# EAGLE design MSP-EXP432P401R_rigid (EAGLE 7.7.0)
AUTHOR: Mike Stein; REV: 2.0
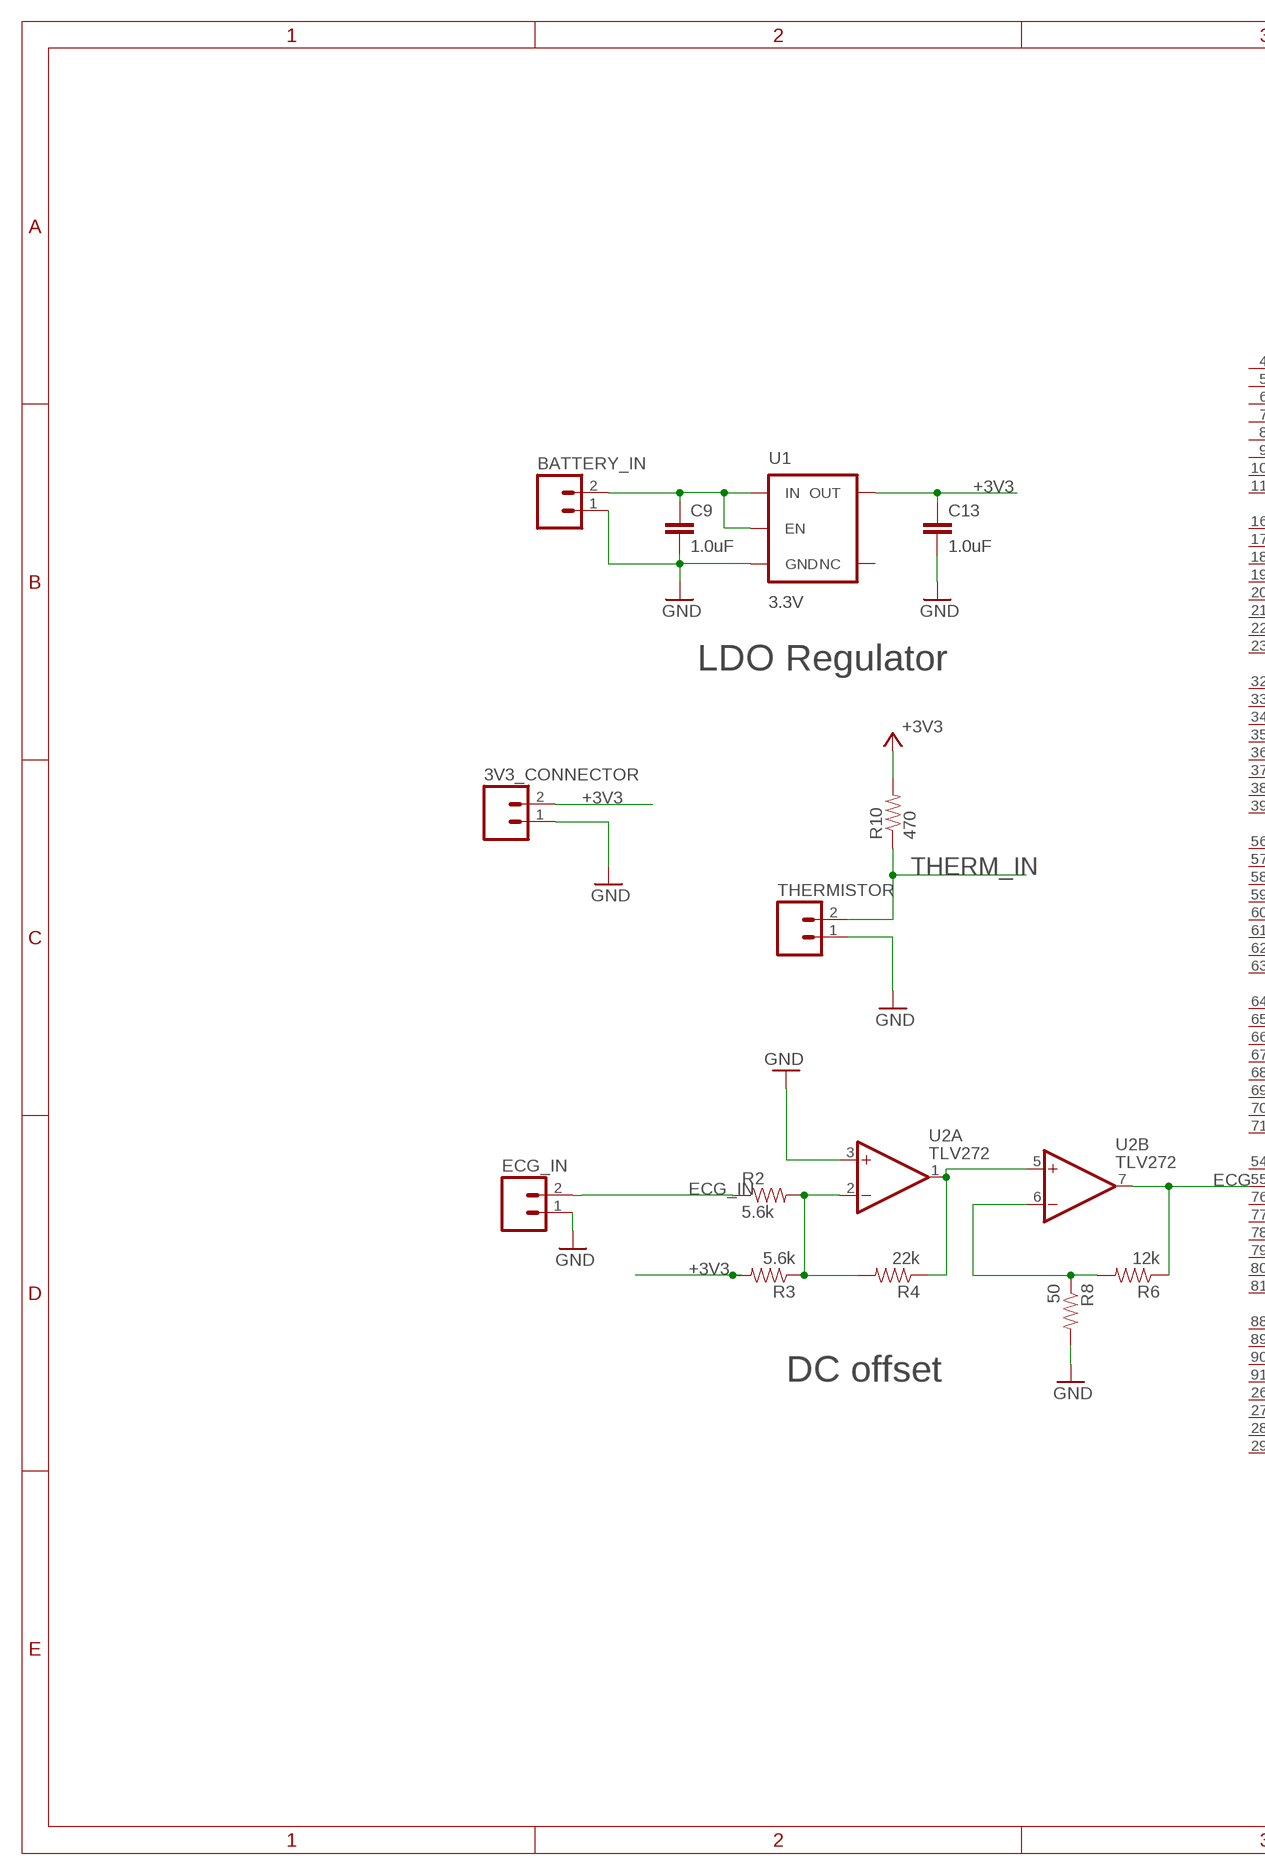
[diagram p0: schematic, sheet 1, part 1 of 2]
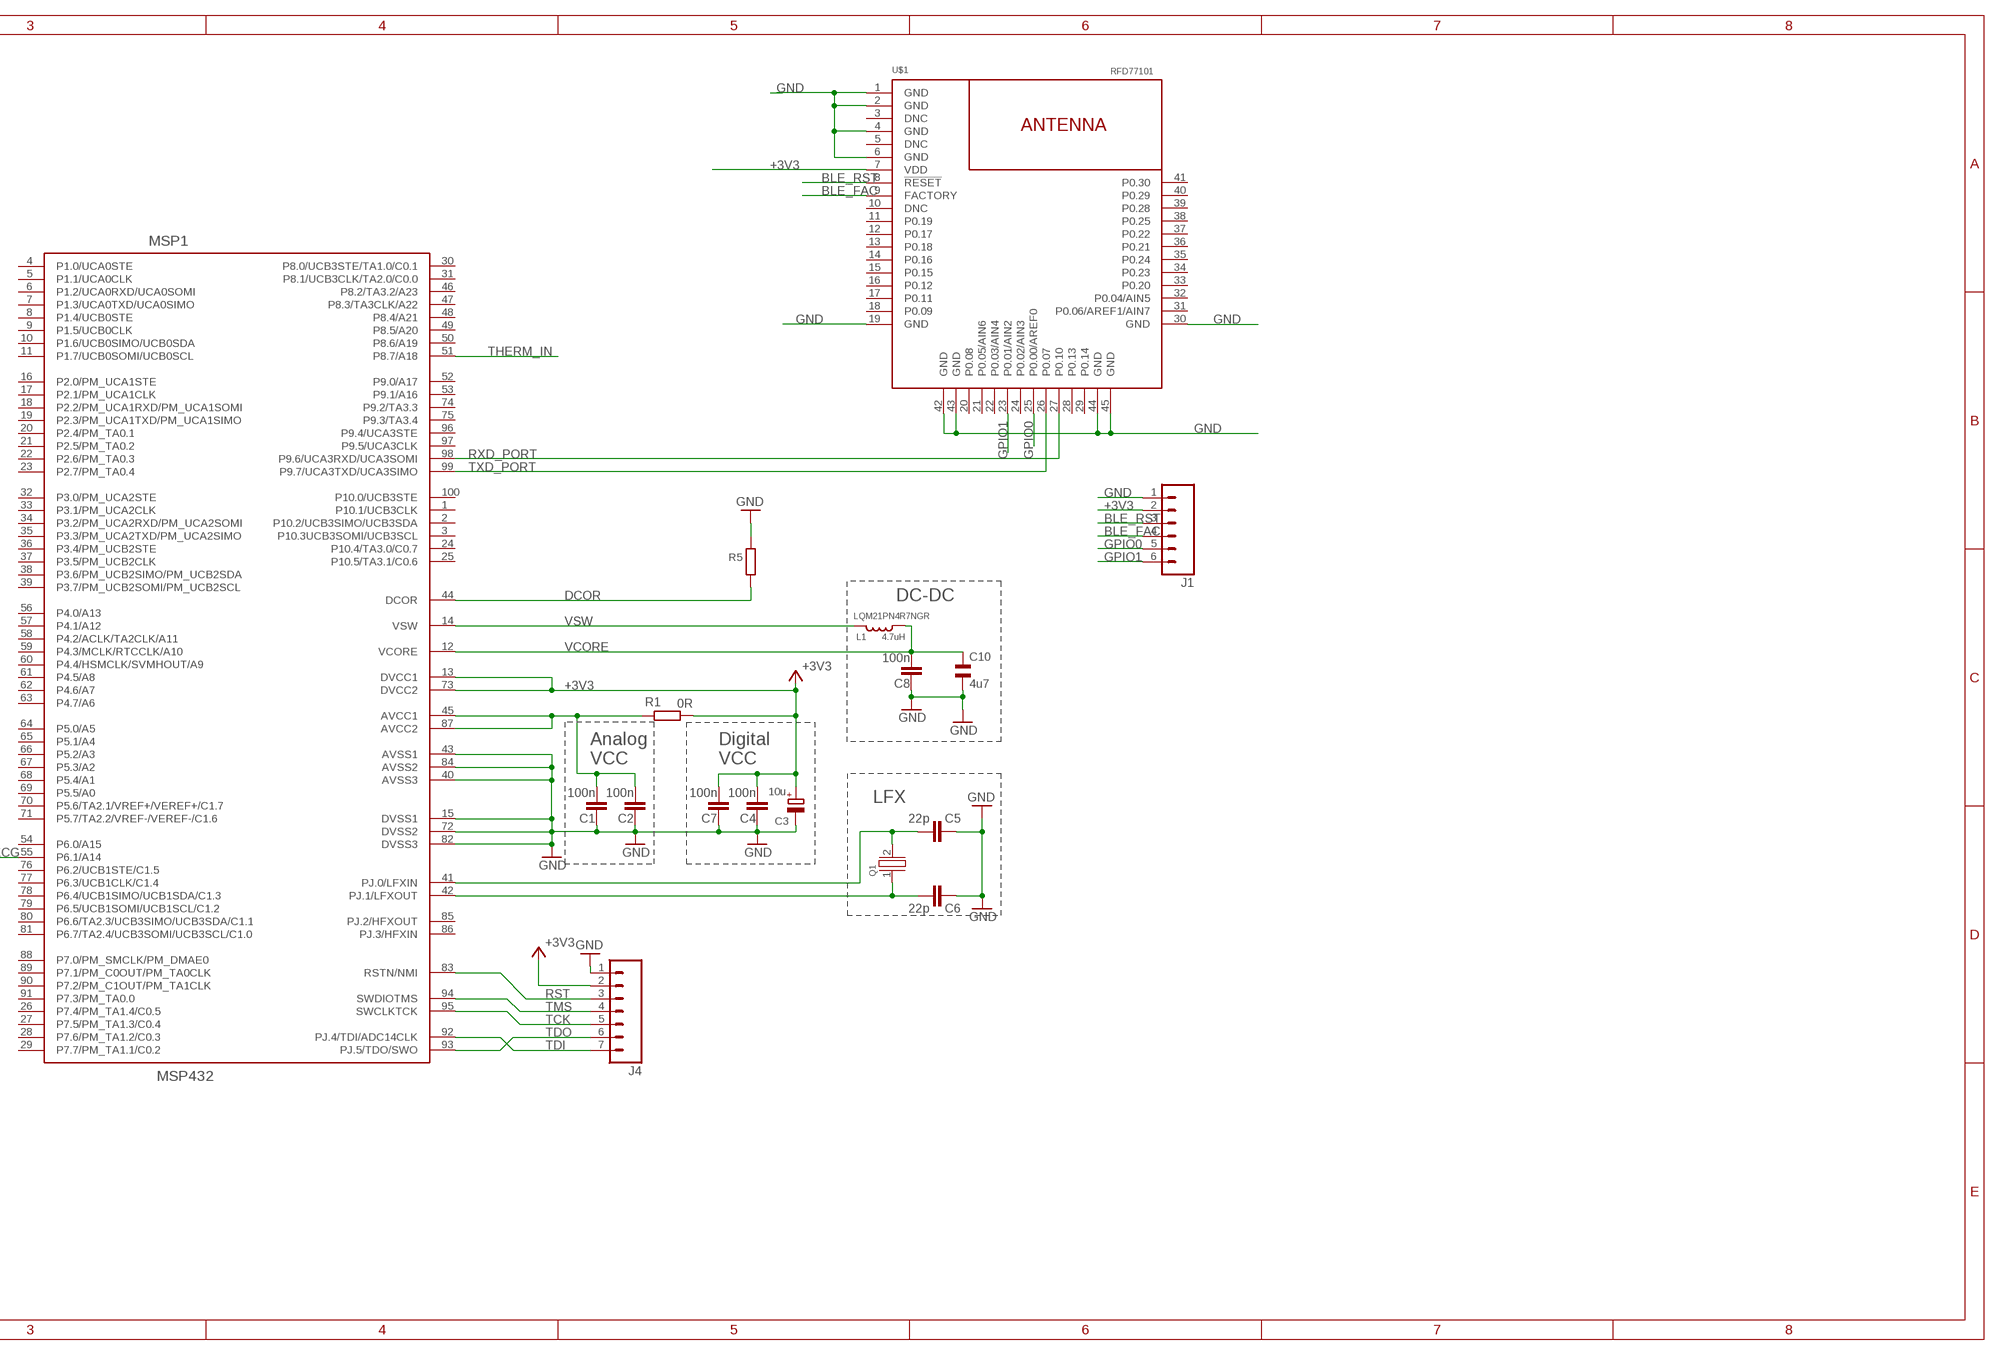
[diagram p1: schematic, sheet 1, part 2 of 2]

## Parts
3V3_CONNECTOR  M02PTH  [1X02]
BATTERY_IN  M02PTH  [1X02]
C1  100n  C-EUCM0402  [0402]
C2  100n  C-EUCM0402  [0402]
C3  10u  CPOL-EUA/3216-18R  [A/3216-18R]
C4  100n  C-EUCM0402  [0402]
C5  22p  C-EUCM0402  [0402]
C6  22p  C-EUCM0402  [0402]
C7  100n  C-EUCM0402  [0402]
C8  100n  C-EUCM0402  [0402]
C9  1.0uF  1.0UF-25V-+80/-20(0805)"  [0805-CAP]
C10  4u7  CSMD0805  [CSMD0805]
C13  1.0uF  1.0UF-25V-+80/-20(0805)"  [0805-CAP]
ECG_IN  M02PTH  [1X02]
J1  M06SILK_FEMALE_PTH  [1X06]
J4  M07  [1X07]
L1  4.7uH  LQM2MP_G0  [0806]
MSP1  MSP432  [PZ100]
Q1  CRYSTALLF_GENERAL  [LF_XTAL]
R1  0R  R-EU_RM0402  [0402]
R2  5.6k  RESISTOR0402-RES  [0402-RES]
R3  5.6k  RESISTOR0402-RES  [0402-RES]
R4  22k  RESISTOR0402-RES  [0402-RES]
R5  R_0805  [0805]
R6  12k  RESISTOR0402-RES  [0402-RES]
R8  50  RESISTOR0402-RES  [0402-RES]
R10  470  RESISTOR0402-RES  [0402-RES]
THERMISTOR  M02PTH  [1X02]
U1  3.3V  V_REG_AP2112K-3.3V  [SOT23-5]
U2  TLV272  TL082D  [SO08]
U$1  RFD77101  [RFD77101]

## Nets
+3V3: 3V3_CONNECTOR.2 C3.+ C4.1 C7.1 C13.1 J1.2 J4.2 MSP1.13(DVCC1) MSP1.73(DVCC2) R1.1 R3.2 R10.2 U1.5(OUT) U$1.7(VDD)
BLE_FAC: J1.4 U$1.9(FACTORY)
BLE_RST: J1.3 U$1.8(!RESET!)
DCOR: MSP1.44(DCOR) R5.1
ECG: MSP1.55(P6.1/A14) R6.1 U2.7(B:OUT)
ECG_IN: ECG_IN.2 R2.1
GND: 3V3_CONNECTOR.1 BATTERY_IN.1 C1.2 C2.2 C3.- C4.2 C5.2 C6.2 C7.2 C8.2 C9.2 C10.2 C13.2 ECG_IN.1 J1.1 J4.1 MSP1.15(DVSS1) MSP1.40(AVSS3) MSP1.43(AVSS1) MSP1.72(DVSS2) MSP1.82(DVSS3) MSP1.84(AVSS2) R5.2 R8.2 THERMISTOR.1 U1.2(GND) U2.3(A:+IN) U$1.1(GND) U$1.2(GND) U$1.4(GND) U$1.6(GND) U$1.19(GND) U$1.30(GND) U$1.42(GND) U$1.43(GND) U$1.44(GND) U$1.45(GND)
GPIO0: J1.5 U$1.25(P0.00/AREF0)
GPIO1: J1.6 U$1.23(P0.01/AIN2)
N$1: BATTERY_IN.2 C9.1 U1.1(IN) U1.3(EN)
N$5: R2.2 R3.1 R4.2 U2.2(A:-IN)
N$6: C1.1 C2.1 MSP1.45(AVCC1) MSP1.87(AVCC2) R1.2
N$7: R4.1 U2.1(A:OUT) U2.5(B:+IN)
N$8: R6.2 R8.1 U2.6(B:-IN)
N$34: C6.1 MSP1.42(PJ.1/LFXOUT) Q1.1
N$38: C5.1 MSP1.41(PJ.0/LFXIN) Q1.2
RST: J4.3 MSP1.83(RSTN/NMI)
RXD_PORT: MSP1.98(P9.6/UCA3RXD/UCA3SOMI) U$1.27(P0.10)
TCK: J4.5 MSP1.95(SWCLKTCK)
TDI: J4.7 MSP1.92(PJ.4/TDI/ADC14CLK)
TDO: J4.6 MSP1.93(PJ.5/TDO/SWO)
THERM_IN: MSP1.51(P8.7/A18) R10.1 THERMISTOR.2
TMS: J4.4 MSP1.94(SWDIOTMS)
TXD_PORT: MSP1.99(P9.7/UCA3TXD/UCA3SIMO) U$1.26(P0.07)
VCORE: C8.1 C10.1 L1.1 MSP1.12(VCORE)
VSW: L1.2 MSP1.14(VSW)
Unconnected: U1.4(NC) U$1.3(DNC) U$1.5(DNC) U$1.10(DNC) U$1.11(P0.19) U$1.12(P0.17) U$1.13(P0.18) U$1.14(P0.16) U$1.15(P0.15) U$1.16(P0.12) U$1.17(P0.11) U$1.18(P0.09) U$1.20(P0.08) U$1.21(P0.05/AIN6) U$1.22(P0.03/AIN4) U$1.24(P0.02/AIN3) U$1.28(P0.13) U$1.29(P0.14) U$1.31(P0.06/AREF1/AIN7) U$1.32(P0.04/AIN5) U$1.33(P0.20) U$1.34(P0.23) U$1.35(P0.24) U$1.36(P0.21) U$1.37(P0.22) U$1.38(P0.25) U$1.39(P0.28) U$1.40(P0.29) U$1.41(P0.30)

## Notes on the sheet
- LDO Regulator
- DC-DC
- LQM21PN4R7NGR
- Analog | Digital
- VCC | VCC
- LFX
- DC offset

## Power pins joined to a net without a drawn wire
P1.0/UCA0STE: MSP1.4(P1.0/UCA0STE)
P1.1/UCA0CLK: MSP1.5(P1.1/UCA0CLK)
P1.2/UCA0RXD/UCA0SOMI: MSP1.6(P1.2/UCA0RXD/UCA0SOMI)
P1.3/UCA0TXD/UCA0SIMO: MSP1.7(P1.3/UCA0TXD/UCA0SIMO)
P1.4/UCB0STE: MSP1.8(P1.4/UCB0STE)
P1.5/UCB0CLK: MSP1.9(P1.5/UCB0CLK)
P1.6/UCB0SIMO/UCB0SDA: MSP1.10(P1.6/UCB0SIMO/UCB0SDA)
P1.7/UCB0SOMI/UCB0SCL: MSP1.11(P1.7/UCB0SOMI/UCB0SCL)
P2.0/PM_UCA1STE: MSP1.16(P2.0/PM_UCA1STE)
P2.1/PM_UCA1CLK: MSP1.17(P2.1/PM_UCA1CLK)
P2.2/PM_UCA1RXD/PM_UCA1SOMI: MSP1.18(P2.2/PM_UCA1RXD/PM_UCA1SOMI)
P2.3/PM_UCA1TXD/PM_UCA1SIMO: MSP1.19(P2.3/PM_UCA1TXD/PM_UCA1SIMO)
P2.4/PM_TA0.1: MSP1.20(P2.4/PM_TA0.1)
P2.5/PM_TA0.2: MSP1.21(P2.5/PM_TA0.2)
P2.6/PM_TA0.3: MSP1.22(P2.6/PM_TA0.3)
P2.7/PM_TA0.4: MSP1.23(P2.7/PM_TA0.4)
P3.0/PM_UCA2STE: MSP1.32(P3.0/PM_UCA2STE)
P3.1/PM_UCA2CLK: MSP1.33(P3.1/PM_UCA2CLK)
P3.2/PM_UCA2RXD/PM_UCA2SOMI: MSP1.34(P3.2/PM_UCA2RXD/PM_UCA2SOMI)
P3.3/PM_UCA2TXD/PM_UCA2SIMO: MSP1.35(P3.3/PM_UCA2TXD/PM_UCA2SIMO)
P3.4/PM_UCB2STE: MSP1.36(P3.4/PM_UCB2STE)
P3.5/PM_UCB2CLK: MSP1.37(P3.5/PM_UCB2CLK)
P3.6/PM_UCB2SIMO/PM_UCB2SDA: MSP1.38(P3.6/PM_UCB2SIMO/PM_UCB2SDA)
P3.7/PM_UCB2SOMI/PM_UCB2SCL: MSP1.39(P3.7/PM_UCB2SOMI/PM_UCB2SCL)
P4.0/A13: MSP1.56(P4.0/A13)
P4.1/A12: MSP1.57(P4.1/A12)
P4.2/ACLK/TA2CLK/A11: MSP1.58(P4.2/ACLK/TA2CLK/A11)
P4.3/MCLK/RTCCLK/A10: MSP1.59(P4.3/MCLK/RTCCLK/A10)
P4.4/HSMCLK/SVMHOUT/A9: MSP1.60(P4.4/HSMCLK/SVMHOUT/A9)
P4.5/A8: MSP1.61(P4.5/A8)
P4.6/A7: MSP1.62(P4.6/A7)
P4.7/A6: MSP1.63(P4.7/A6)
P5.0/A5: MSP1.64(P5.0/A5)
P5.1/A4: MSP1.65(P5.1/A4)
P5.2/A3: MSP1.66(P5.2/A3)
P5.3/A2: MSP1.67(P5.3/A2)
P5.4/A1: MSP1.68(P5.4/A1)
P5.5/A0: MSP1.69(P5.5/A0)
P5.6/TA2.1/VREF+/VEREF+/C1.7: MSP1.70(P5.6/TA2.1/VREF+/VEREF+/C1.7)
P5.7/TA2.2/VREF-/VEREF-/C1.6: MSP1.71(P5.7/TA2.2/VREF-/VEREF-/C1.6)
P6.0/A15: MSP1.54(P6.0/A15)
P6.2/UCB1STE/C1.5: MSP1.76(P6.2/UCB1STE/C1.5)
P6.3/UCB1CLK/C1.4: MSP1.77(P6.3/UCB1CLK/C1.4)
P6.4/UCB1SIMO/UCB1SDA/C1.3: MSP1.78(P6.4/UCB1SIMO/UCB1SDA/C1.3)
P6.5/UCB1SOMI/UCB1SCL/C1.2: MSP1.79(P6.5/UCB1SOMI/UCB1SCL/C1.2)
P6.6/TA2.3/UCB3SIMO/UCB3SDA/C1.1: MSP1.80(P6.6/TA2.3/UCB3SIMO/UCB3SDA/C1.1)
P6.7/TA2.4/UCB3SOMI/UCB3SCL/C1.0: MSP1.81(P6.7/TA2.4/UCB3SOMI/UCB3SCL/C1.0)
P7.0/PM_SMCLK/PM_DMAE0: MSP1.88(P7.0/PM_SMCLK/PM_DMAE0)
P7.1/PM_C0OUT/PM_TA0CLK: MSP1.89(P7.1/PM_C0OUT/PM_TA0CLK)
P7.2/PM_C1OUT/PM_TA1CLK: MSP1.90(P7.2/PM_C1OUT/PM_TA1CLK)
P7.3/PM_TA0.0: MSP1.91(P7.3/PM_TA0.0)
P7.4/PM_TA1.4/C0.5: MSP1.26(P7.4/PM_TA1.4/C0.5)
P7.5/PM_TA1.3/C0.4: MSP1.27(P7.5/PM_TA1.3/C0.4)
P7.6/PM_TA1.2/C0.3: MSP1.28(P7.6/PM_TA1.2/C0.3)
P7.7/PM_TA1.1/C0.2: MSP1.29(P7.7/PM_TA1.1/C0.2)
P8.0/UCB3STE/TA1.0/C0.1: MSP1.30(P8.0/UCB3STE/TA1.0/C0.1)
P8.1/UCB3CLK/TA2.0/C0.0: MSP1.31(P8.1/UCB3CLK/TA2.0/C0.0)
P8.2/TA3.2/A23: MSP1.46(P8.2/TA3.2/A23)
P8.3/TA3CLK/A22: MSP1.47(P8.3/TA3CLK/A22)
P8.4/A21: MSP1.48(P8.4/A21)
P8.5/A20: MSP1.49(P8.5/A20)
P8.6/A19: MSP1.50(P8.6/A19)
P9.0/A17: MSP1.52(P9.0/A17)
P9.1/A16: MSP1.53(P9.1/A16)
P9.2/TA3.3: MSP1.74(P9.2/TA3.3)
P9.3/TA3.4: MSP1.75(P9.3/TA3.4)
P9.4/UCA3STE: MSP1.96(P9.4/UCA3STE)
P9.5/UCA3CLK: MSP1.97(P9.5/UCA3CLK)
P10.0/UCB3STE: MSP1.100(P10.0/UCB3STE)
P10.1/UCB3CLK: MSP1.1(P10.1/UCB3CLK)
P10.2/UCB3SIMO/UCB3SDA: MSP1.2(P10.2/UCB3SIMO/UCB3SDA)
P10.3UCB3SOMI/UCB3SCL: MSP1.3(P10.3UCB3SOMI/UCB3SCL)
P10.4/TA3.0/C0.7: MSP1.24(P10.4/TA3.0/C0.7)
P10.5/TA3.1/C0.6: MSP1.25(P10.5/TA3.1/C0.6)
PJ.2/HFXOUT: MSP1.85(PJ.2/HFXOUT)
PJ.3/HFXIN: MSP1.86(PJ.3/HFXIN)
V+: U2.8(P:V+)
V-: U2.4(P:V-)

## Library data of the parts
3V3_CONNECTOR BATTERY_IN ECG_IN THERMISTOR = SparkFun-Connectors:M02: Standard 2-pin 0.1" header. Use with - straight break away headers ( PRT-00116) - right angle break away headers (PRT-00553) - swiss pins (PRT-00743) - machine pins (PRT-00117) - female headers (PRT-00115) Molex polarized connector foot print use with: PRT-08233 with associated crimp pins and housings. 2.54_SCREWTERM for use with PRT-10571. 3.5mm Screw Terminal footprints for PRT-08084 5mm Screw Terminal footprints for use with PRT-08432
C1 C2 C4-C8 = rcl:C-EU: CAPACITOR, European symbol
C3 = rcl:CPOL-EU: POLARIZED CAPACITOR, European symbol
C9 C13 = SparkFun-Capacitors:1.0UF-25V-+80/-20(0805): CAP-11625; PROD_ID: CAP-11625
C10 = cap:CSMD0805
J1 = SparkFun-Connectors:M06: Header 6 Standard 6-pin 0.1" header. Use with straight break away headers (SKU : PRT-00116), right angle break away headers (PRT-00553), swiss pins (PRT-00743), machine pins (PRT-00117), and female headers (PRT-00115). Molex polarized connector foot print use with SKU : PRT-08094 with associated crimp pins and housings. NOTES ON THE VARIANTS LOCK and LOCK_LONGPADS... This footprint was designed to help hold the alignment of a through-hole component (i.e. 6-pin header) while soldering it into place. You may notice that each hole has been shifted either up or down by 0.005 of an inch from it's more standard position (which is a perfectly straight line). This slight alteration caused the pins (the squares in the middle) to touch the edges of the holes. Because they are alternating, it causes a "brace" to hold the component in place. 0.005 has proven to be the perfect amount of "off-center" position when using our standard breakaway headers. Although looks a little odd when you look at the bare footprint, once you have a header in there, the alteration is very hard to notice. Also,if you push a header all the way into place, it is covered up entirely on the bottom side. This idea of altering the position of holes to aid alignment will be further integrated into the Sparkfun Library for other footprints. It can help hold any component with 3 or more connection pins.; PROD_ID: CONN-08437
J4 = SparkFun-Connectors:M07: Header 7 Standard 7-pin 0.1" header. Use with straight break away headers (SKU : PRT-00116), right angle break away headers (PRT-00553), swiss pins (PRT-00743), machine pins (PRT-00117), and female headers (PRT-00115). NOTES ON THE VARIANTS LOCK and LOCK_LONGPADS... This footprint was designed to help hold the alignment of a through-hole component (i.e. 7-pin header) while soldering it into place. You may notice that each hole has been shifted either up or down by 0.005 of an inch from it's more standard position (which is usually a perfectly straight line). This slight alteration caused the pins (the squares in the middle) to touch the edges of the holes. Because they are alternating, it causes a "brace" to hold the header in place. 0.005 has proven to be the perfect amount of "off-center" position when using our standard breakaway headers. Although looks a little odd when you look at the bare footprint, once you have a header in there, the alteration is very hard to notice. Also, if you push a header all the way into place, it is covered up entirely on the bottom side. This idea of altering the position of holes to aid alignment will be further integrated into the Sparkfun Library for other footprints. It can help hold any component with 3 or more connection pins.
L1 = Murata:LQM2MP_G0
MSP1 = MSP-EXP432:MSP432
Q1 = MSP_Crystals:CRYSTAL
R1 = rcl:R-EU_: RESISTOR, European symbol
R2-R4 R6 R8 R10 = SparkFun-Passives:RESISTOR: Resistor Basic schematic elements and footprints for 0603, 1206, and PTH resistors.
R5 = smd:R_0805
U1 = SparkFun-PowerIC:V_REG_AP2112: AP2112 - 600mA CMOS LDO Regulator w/ Enable The AP2112 is CMOS process low dropout linear regulator with enable function, the regulator delivers a guaranteed 600mA (min.) continuous load current. Features Output Voltage Accuracy: ±1.5% Output Current: 600mA (Min.) Foldback Short Current Protection: 50mA Enable Function to Turn ON/OFF VOUT Low Dropout Voltage (3.3V): 250mV (Typ.) @IOUT=600mA Excellent Load Regulation: 0.2%/A (Typ.) Excellent Line Regulation: 0.02%/V (Typ.) Low Quiescent Current: 55μA (Typ.) Low Standby Current: 0.01μA (Typ.) Low Output Noise: 50μVRMS PSRR: 100Hz -65dB, 1kHz -65dB OTSD Protection Stable with 1.0μF Flexible Cap: Ceramic, Tantalum and Aluminum Electrolytic Operation Temperature Range: -40°C to 85°C ESD: MM 400V, HBM 4000V; PROD_ID: VREG-12457
U2 = op-amp:TL082: JFET OP-AMP - Dual
U$1 = RFDigital:RFD77101: Simblee ™ BLE Module RFD77101 © 2015 RF Digital Corporation www.RFDigital.com www.Simblee.com PATENTS PENDING 04.01.2015

## Net classes
0 default: width 0.254 mm
1 Ground: width 0.203 mm, drill 0.305 mm, clearance 0.152 mm to class 0, clearance 0.152 mm
2 Power: width 0.203 mm, drill 0.305 mm, clearance 0.152 mm to class 0, clearance 0.152 mm to class 1, clearance 0.152 mm

## Board
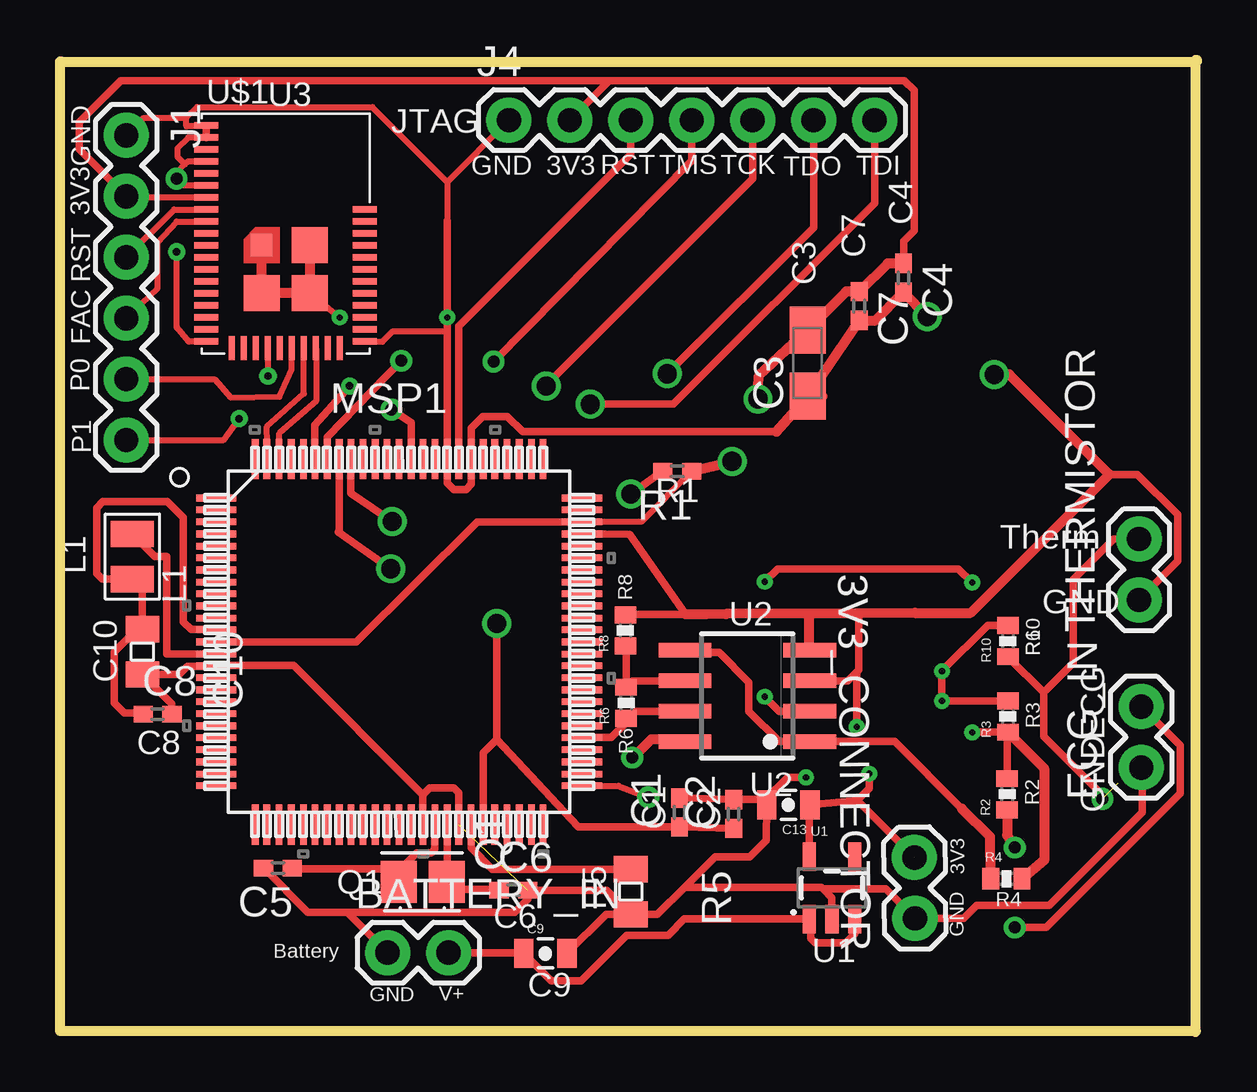
[diagram p2: board, top side]
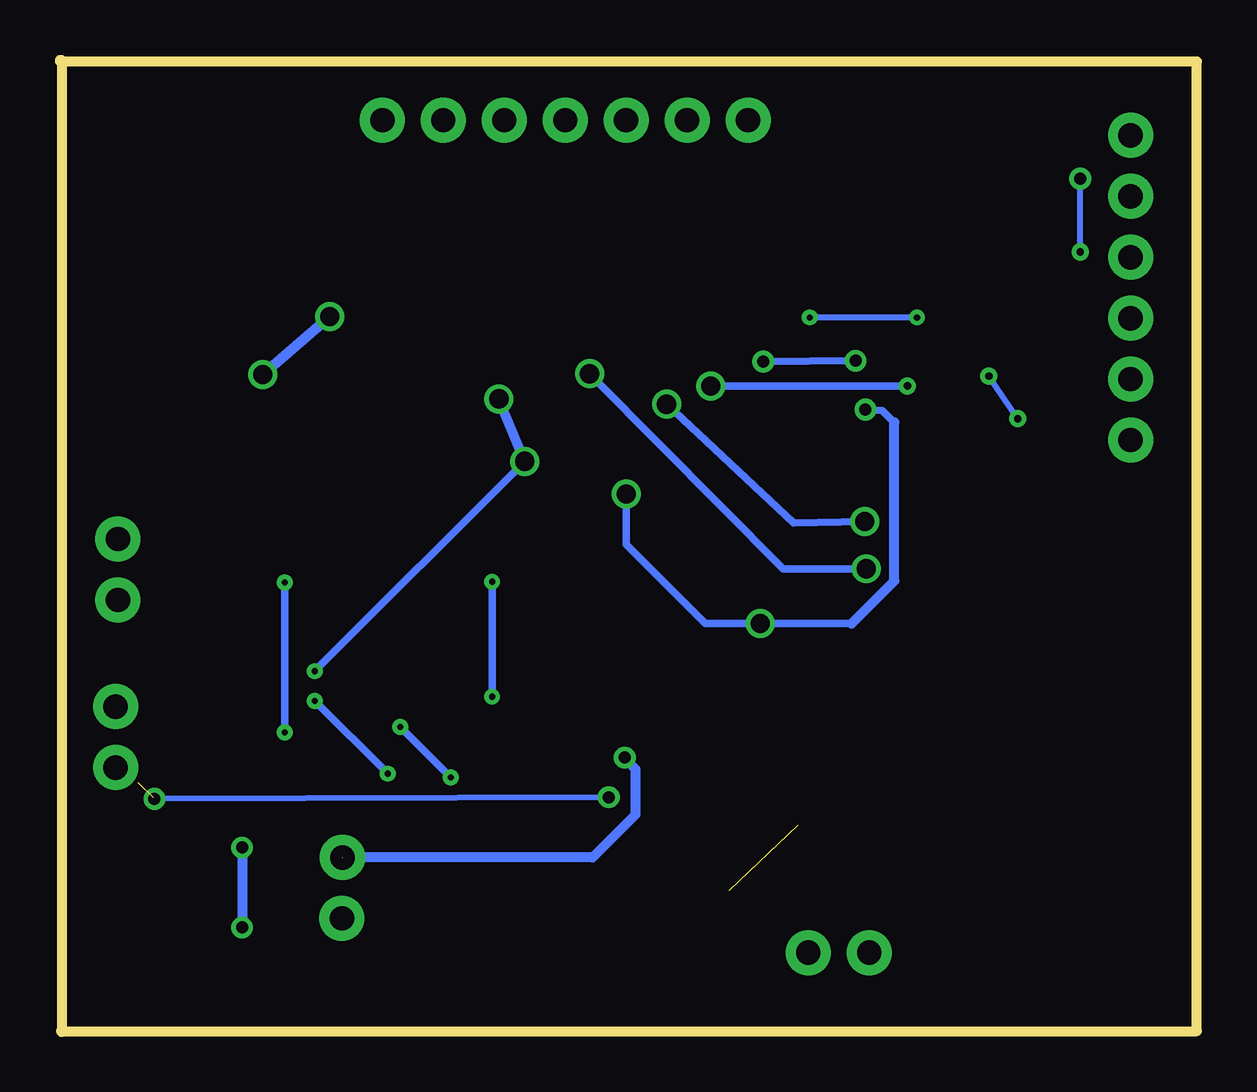
[diagram p3: board, bottom side, seen from below]

Size 47.37 x 40.51 mm. Coordinates in mm from the lower left corner, seen from the top.
Outline: 0.06,40.45 47.37,40.45
Outline: 47.34,0.03 0,0.03 0,40.45
Outline: 47.37,40.51 47.31,40.51 47.31,0
Copper layers (1*16): Top 0.035mm / dielectric 1.5mm / Bottom 0.035mm
Design rules "default": minimum track width 10mil, minimum drill 24mil, track to track 8mil, track to pad 8mil, pad to pad 8mil, via to via 8mil, smd to smd 8mil, copper to edge 40mil, drill to drill 8mil, minimum pad ring 10mil, minimum via ring 8mil, stop-mask expansion 4mil, vias tented up to drill 0mil, thermal gap 10mil

### Footprints (pad centres in the part's own frame; a part is rotated, then mirrored left to right if it is on the bottom)
1X02 = drill 1.016 pad 1.88: 1 0,0; 2 2.54,0
0402 = smd 0.8 x 0.7: 1 -0.6,0; 2 0.6,0
A/3216-18R = smd 1.95 x 1.5: + 1.375,0; - -1.375,0
0805-CAP = smd 0.8 x 1.2: 1 -0.9,0; 2 0.9,0
CSMD0805 = smd 1.092 x 1.397: 1 -0.94,0; 2 0.94,0
1X06 = drill 1.016 pad 1.88: 1 0,0; 2 2.54,0; 3 5.08,0; 4 7.62,0; 5 10.16,0; 6 12.7,0
1X07 = drill 1.016 pad 1.88: 1 0,0; 2 2.54,0; 3 5.08,0; 4 7.62,0; 5 10.16,0; 6 12.7,0; 7 15.24,0
0806 = smd 1.1 x 1.8: 1 -0.94,0; 2 0.94,0
PZ100 = smd 1.676 x 0.279: 1 -7.62,5.994; 2 -7.62,5.512; 3 -7.62,5.004; 4 -7.62,4.496; 5 -7.62,3.988; 6 -7.62,3.505; 7 -7.62,2.997; 8 -7.62,2.489; 9 -7.62,2.007; 10 -7.62,1.499; 11 -7.62,0.991; 12 -7.62,0.508; 13 -7.62,0; 14 -7.62,-0.508; 15 -7.62,-0.991; 16 -7.62,-1.499; 17 -7.62,-2.007; 18 -7.62,-2.489; 19 -7.62,-2.997; 20 -7.62,-3.505; 21 -7.62,-3.988; 22 -7.62,-4.496; 23 -7.62,-5.004; 24 -7.62,-5.512; 25 -7.62,-5.994; 51 7.62,-5.994; 52 7.62,-5.512; 53 7.62,-5.004; 54 7.62,-4.496; 55 7.62,-3.988; 56 7.62,-3.505; 57 7.62,-2.997; 58 7.62,-2.489; 59 7.62,-2.007; 60 7.62,-1.499; 61 7.62,-0.991; 62 7.62,-0.508; 63 7.62,0; 64 7.62,0.508; 65 7.62,0.991; 66 7.62,1.499; 67 7.62,2.007; 68 7.62,2.489; 69 7.62,2.997; 70 7.62,3.505; 71 7.62,3.988; 72 7.62,4.496; 73 7.62,5.004; 74 7.62,5.512; 75 7.62,5.994 | smd 0.279 x 1.676: 26 -5.994,-7.62; 27 -5.512,-7.62; 28 -5.004,-7.62; 29 -4.496,-7.62; 30 -3.988,-7.62; 31 -3.505,-7.62; 32 -2.997,-7.62; 33 -2.489,-7.62; 34 -2.007,-7.62; 35 -1.499,-7.62; 36 -0.991,-7.62; 37 -0.508,-7.62; 38 0,-7.62; 39 0.508,-7.62; 40 0.991,-7.62; 41 1.499,-7.62; 42 2.007,-7.62; 43 2.489,-7.62; 44 2.997,-7.62; 45 3.505,-7.62; 46 3.988,-7.62; 47 4.496,-7.62; 48 5.004,-7.62; 49 5.512,-7.62; 50 5.994,-7.62; 76 5.994,7.62; 77 5.512,7.62; 78 5.004,7.62; 79 4.496,7.62; 80 3.988,7.62; 81 3.505,7.62; 82 2.997,7.62; 83 2.489,7.62; 84 2.007,7.62; 85 1.499,7.62; 86 0.991,7.62; 87 0.508,7.62; 88 0,7.62; 89 -0.508,7.62; 90 -0.991,7.62; 91 -1.499,7.62; 92 -2.007,7.62; 93 -2.489,7.62; 94 -2.997,7.62; 95 -3.505,7.62; 96 -3.988,7.62; 97 -4.496,7.62; 98 -5.004,7.62; 99 -5.512,7.62; 100 -5.994,7.62
LF_XTAL = smd 1.75 x 1.5: 1 0,1; 2 0,-1
0402-RES = smd 0.7 x 0.9: 1 -0.65,0; 2 0.65,0
0805 = smd 1.092 x 1.397: 1 -0.94,0; 2 0.94,0
SOT23-5 = smd 0.55 x 1.2: 1 -0.95,-1.3; 2 0,-1.3; 3 0.95,-1.3; 4 0.95,1.3; 5 -0.95,1.3
SO08 = smd 0.6 x 2.2: 1 -1.905,-2.6; 2 -0.635,-2.6; 3 0.635,-2.6; 4 1.905,-2.6; 5 1.905,2.6; 6 0.635,2.6; 7 -0.635,2.6; 8 -1.905,2.6
RFD77101 = smd 1 x 0.254: 1 0,0; 2 0,-0.5; 3 0,-1; 4 0,-1.5; 5 0,-2; 6 0,-2.5; 7 0,-3; 8 0,-3.5; 9 0,-4; 10 0,-4.5; 11 0,-5; 12 0,-5.5; 13 0,-6; 14 0,-6.5; 15 0,-7; 16 0,-7.5; 17 0,-8; 18 0,-8.5; 19 0,-9; 30 6.61,-9; 31 6.61,-8.5; 32 6.61,-8; 33 6.61,-7.5; 34 6.61,-7; 35 6.61,-6.5; 36 6.61,-6; 37 6.61,-5.5; 38 6.61,-5; 39 6.61,-4.5; 40 6.61,-4; 41 6.61,-3.5 | smd 0.254 x 1: 20 1.055,-9.29; 21 1.555,-9.29; 22 2.055,-9.29; 23 2.555,-9.29; 24 3.055,-9.29; 25 3.555,-9.29; 26 4.055,-9.29; 27 4.555,-9.29; 28 5.055,-9.29; 29 5.555,-9.29 | smd 0.9 x 0.9: 42 2.3,-4.99 | smd 1.5 x 1.5: 43 2.3,-6.99; 44 4.3,-6.99; 45 4.3,-4.99

### Placement (x,y rotation side)
3V3_CONNECTOR  35.62,4.73 90.5 top
BATTERY_IN  13.65,3.3 0 top
C1  25.81,9.14 90 top
C2  28.07,9.08 90 top
C3  31.15,27.88 90 top
C4  35.15,31.43 270 top
C5  9.08,6.83 180 top
C6  18.89,5.91 0 top
C7  33.31,30.26 270 top
C8  4.06,13.24 0 top
C9  20.22,3.27 0 top
C10  3.43,15.84 270 top
C13  30.35,9.46 180 top
ECG_IN  45.05,11.02 90 top
J1  2.76,37.37 270 top
J4  18.7,38 0 top
L1  3.02,19.81 90 top
MSP1  14.13,16.26 0 top
Q1  15.11,6.25 270 top
R1  25.72,23.37 180 top
R2  39.47,9.91 90 top
R3  39.5,13.14 90 top
R4  39.43,6.38 0 top
R5  23.78,5.84 270 top
R6  23.59,13.72 90 top
R8  23.56,16.73 90 top
R10  39.5,16.29 90 top
THERMISTOR  44.96,18 90 top
U1  32.16,6 0 top
U2  28.64,14 90 top
U$1  6.1,37.78 0 top

### Tracks (layer width: path | path; a pad name or v marks a point on that pad's centre or on a via)
+3V3  (via drill 0.25 pad 0.3, 0.8)  (1 unrouted)
  Top 0.254: 21.84,21.3 21.79,21.3 MSP1.73 24.21,21.26 R1.1 | U$1.7 2.81,34.78 J1.2
  Top 0.305: MSP1.13 12.35,16.26 17.3,21.18 17.39,21.26 MSP1.73 | U1.5 31.21,9.64 C13.1 33.22,9.65 | 3V3_CONNECTOR.2 33.22,9.65 | 33.22,9.65 33.72,10.15 v33.72,10.76 | R3.2 v36.75,13.8 v36.75,15.03 38.65,16.94 R10.2 | J4.2 22.89,39.66 | 22.89,39.66 35.18,39.66 35.59,39.24 35.59,33.4 35.15,32.96 C4.1 | J1.2 0.79,36.8 0.79,37.91 2.54,39.66 22.89,39.66
  Top 0.406: C4.1 34.48,32.03 C7.1 32.75,30.86 C3.+ 29.11,27.35 v29.08,26.38 | R1.1 v28,23.78
  Bottom 0.305: v33.72,10.76 v36.75,13.8 | v28,23.78 v36.75,15.03
  Bottom 0.406: v28,23.78 v29.08,26.38 | 23.88,11.43 23.4,10.95 23.4,9.05 25.18,7.27 3V3_CONNECTOR.2
BLE_FAC
  Top 0.254: J1.4 4.06,30.99 4.06,32.92 4.86,33.78 U$1.9
BLE_RST
  Top 0.254: J1.3 4.75,34.28 U$1.8
DCOR
  Top 0.305: R5.1 18.01,6.78 17.13,7.67 MSP1.44
ECG
  Top 0.305: MSP1.55 22.97,12.27 23.59,12.88 R6.1 23.89,13.37 U2.7
ECG_IN  (via drill 0.5)
  Top 0.305: ECG_IN.2 46.67,11.94 46.67,9.94 41.08,4.35 v39.78,4.35
  Top 0.406: R2.1 39.46,8.19 v39.78,7.68
  Bottom 0.406: v39.78,7.68 v39.78,4.35
GND  (via drill 0.25 pad 0.3, 0.3 pad 0.3, 0.5 pad 0.3, 0.8)  (1 unrouted)
  Top 0.254: U$1.19 6.08,28.77 5.37,28.77 4.86,29.37 v4.86,32.51 | 5.27,38.1 5.27,37.75 6.06,37.75 U$1.1 | 5.27,38.1 5.71,38.55 13.02,38.55 16.14,35.43 | 16.14,35.43 16.14,33.81 | U$1.6 4.83,35.27 v4.86,35.56 4.89,35.85 5.21,36.16 | U$1.30 12.72,28.77 13.43,28.77 13.87,29.21 16.14,29.21 | J4.1 16.14,35.43 | U$1.44 v11.66,29.78 | J1.1 3.49,38.1 5.27,38.1 | U$1.4 5.33,36.28 5.21,36.16 | U$1.2 5.34,37.28 4.89,36.83 4.89,36.48 5.21,36.16
  Top 0.305: 22.69,20.75 MSP1.72 23.74,20.73 26.07,17.4 | MSP1.40 15.12,9.88 | 15.12,9.88 15.4,10.16 16.41,10.16 16.62,9.96 MSP1.43 | 15.12,9.88 9.73,15.27 MSP1.15 6.48,15.24 5.3,15.24 4.97,14.9 C10.2 4.66,13.67 C8.2 | 16.14,33.81 v16.14,29.78 16.14,29.21 MSP1.84 16.14,22.88 16.41,22.61 16.92,22.61 17.14,22.83 17.14,23.86 | C1.2 C2.2 29.39,9.68 | 17.14,23.86 17.14,25.18 17.62,25.65 18.64,25.65 19.27,25.02 29.84,25.02 | MSP1.82 17.14,23.86 | 33.17,17.45 33.27,17.35 33.27,15.08 33.19,15 | C5.2 10.32,4.98 11.97,4.98 | 11.97,4.98 18.95,4.98 19.49,5.52 C6.2 22.78,5.91 R5.2 | BATTERY_IN.1 11.97,4.98 | R8.2 23.58,17.41 26.93,17.41 | U2.3 32.83,14.64 33.19,15 | R5.2 23.79,4.89 24.89,4.89 26.03,6.03 | 26.03,6.03 27.3,7.3 28.73,7.3 29.42,7.99 C13.2 29.39,9.68 | C9.2 22.76,4.9 R5.2 | U1.2 32.16,5.59 31.8,5.95 | 31.8,5.95 31.72,6.03 26.03,6.03 | 31.8,5.95 34.4,5.95 3V3_CONNECTOR.1 37.66,4.73 38.2,5.27 41.21,5.27 45.08,9.14 45.08,10.99 ECG_IN.1 | U$1.1 U$1.2 | 29.39,9.68 30.32,10.6 v31.08,10.6 | v33.19,12.72 33.19,15 | THERMISTOR.1 46.58,19.62 46.58,21.56 44.89,23.24 43.72,23.24
  Top 0.406: 26.07,17.4 26.93,17.41 27.75,17.41 33.17,17.45 35.62,17.46 37.94,17.46 43.72,23.24 39.56,27.4 v38.93,27.4 | 31.77,26.5 C3.- | C3.- C7.2 33.97,29.66 C4.2 | 29.84,25.02 C3.- | v36.13,29.81 C4.2 | C4.2 | U$1.45 U$1.44 U$1.43 U$1.42
  Bottom 0.254: v11.66,29.78 v16.14,29.78 | v4.86,32.51 v4.86,35.56
  Bottom 0.305: v31.08,10.6 v33.19,12.72
  Bottom 0.406: v38.93,27.4 v36.13,29.81
GPIO0
  Top 0.254: U$1.25 9.65,27.62 9.14,26.48 7.11,26.45 6.45,27.21 J1.5
GPIO1  (via drill 0.3 pad 0.3)
  Top 0.254: J1.6 6.83,24.67 v7.46,25.56 | v8.67,27.34 8.67,28.48 U$1.23
  Bottom 0.254: v7.46,25.56 v8.67,27.34
N$1
  Top 0.305: BATTERY_IN.2 19.29,3.3 C9.1 20.47,2.13 21.72,2.13 23.62,4.03 25.34,4.03 26,4.7 U1.1 31.27,4.64 31.27,3.91 31.46,3.71 32.73,3.71 33.11,4.09 U1.3
N$5  (via drill 0.25 pad 0.3)
  Top 0.305: R2.2 39.46,12.46 R3.1 38.02,12.49 v38,12.48 | U2.2 29.97,13.37 v29.37,13.97 | v29.37,18.76 29.91,19.3 37.43,19.3 v38,18.73
  Top 0.406: R3.1 41,10.99 41,7.14 R4.2
  Bottom 0.305: v29.37,13.97 v29.37,18.76 | v38,18.73 v38,12.48
N$6  (via drill 0.5, 0.8)
  Top 0.305: C1.1 C2.1 | 18.19,12.19 21.59,8.54 21.6,8.54 C1.1 | MSP1.87 14.64,25.4 v13.81,25.94 | v18.19,17.02 18.19,12.19 | 18.19,12.19 17.63,11.63 MSP1.45 | R1.2 v23.78,22.42 | C1.1
  Bottom 0.305: v13.81,25.94 13.11,25.91 12.6,25.4 | v23.78,22.42 23.78,20.32 20.48,17.02 v18.19,17.02 14.38,17.02
  Bottom 0.406: 14.38,17.02 12.6,18.8 12.6,25.4
N$7
  Top 0.305: U2.5 26.13,15.81 27.46,15.81 28.7,14.57 28.7,13.37 29.97,12.1 U2.1 34.78,12.1 37.58,9.3
  Top 0.406: R4.1 38.75,8.13 37.58,9.3
N$8
  Top 0.305: R8.1 23.59,16.05 R6.2 23.86,14.64 U2.6
N$10
  Top 0.406: 31.21,16 31.21,17.43
N$11
  Top 0.406: 26.19,12.19 24.64,12.19 23.88,11.43
N$12  (via drill 0.5)
  other vias: 23.84,11.43
N$34
  Top 0.305: MSP1.42 16.14,6.45 Q1.1 16.43,5.94 | C6.1 18.26,5.94 16.48,5.94 16.43,5.94 | 16.43,5.94 15.53,5.94
N$38
  Top 0.305: MSP1.41 15.62,7.62 15.46,7.46 14.86,7.46 14.19,6.8 | 14.19,6.8 14.11,6.71 Q1.2 | C5.1 9.71,6.8 14.19,6.8
RST
  Top 0.305: J4.3 23.78,36.58 16.62,29.41 MSP1.83
RXD_PORT
  Top 0.254: 9.14,23.89 9.14,24.96 10.67,26.29 10.67,28.48 U$1.27
  Top 0.305: MSP1.98 9.14,23.89
TCK  (via drill 0.3, 0.8)
  Top 0.305: J4.5 28.86,35.56 20.48,27.18 v20.26,26.92 | MSP1.95 10.62,25.29 v12.06,26.92
  Bottom 0.305: v20.26,26.92 v12.06,26.92
TDI  (via drill 0.8)
  Top 0.305: J4.7 33.94,34.54 25.56,26.16 v22.1,26.16 | v13.84,21.27 12.13,22.45 12.12,22.45 MSP1.92
  Bottom 0.305: v13.84,21.27 16.8,21.21 v22.1,26.16
TDO  (via drill 0.8)
  Top 0.305: J4.6 31.4,33.53 v25.3,27.43 | v13.78,19.3 11.59,20.83 11.64,20.88 MSP1.93
  Bottom 0.305: v25.3,27.43 25.05,27.18 17.24,19.3 v13.78,19.3
THERM_IN  (via drill 0.5)  (1 unrouted)
  Top 0.254: MSP1.51 23.27,10.26 v24.51,9.78 | v43.43,9.71 43.47,9.75
  Top 0.305: R10.1 40.99,14.14 | 40.99,14.14 40.99,12.32 43.43,9.87 v43.43,9.71 | 40.99,14.14 42.23,15.38 42.23,18.86 43.91,20.54 THERMISTOR.2
  Bottom 0.254: v24.51,9.78 v43.43,9.71
TMS  (via drill 0.5)
  Top 0.305: J4.4 26.32,36.32 v18.07,27.94 | v14.22,27.97 11.13,24.78 MSP1.94
  Bottom 0.305: v18.07,27.94 v14.22,27.97
TXD_PORT
  Top 0.254: 8.65,23.88 8.62,25.22 10.16,26.61 10.16,28.48 U$1.26
  Top 0.305: 8.65,23.88 MSP1.99
VCORE
  Top 0.305: C10.1 3.45,16.76 | C10.1 3.43,18.87 L1.1 1.77,18.87 1.52,19.11 1.52,21.84 1.78,22.1 4.48,22.1 5.14,21.43 5.14,17.08 5.46,16.76 MSP1.12 | C8.1 3.4,13.3 2.67,13.3 2.25,13.72 2.25,15.84 3.19,16.78 C10.1
VSW
  Top 0.305: L1.2 3.96,19.81 4.44,19.81 4.44,15.75 MSP1.14

### Text on the board
tPlace: U3 | GND | JTAG | GND | 3V3 | RST | TMS | TCK | TDO | TDI | 3V3 | RST | C4 | C7 | FAC | C3 | P0 | P1 | R1 | Therm | L1 | R8 | GND | U2 | R10 | R6 | ECG | C10 | R3 | GND | C8 | R6 | C2 | R2 | C1 | Q1 | R5 | 3V3 | R4 | C6 | GND | Battery | U1 | GND | V+ | C9